# EAGLE design TRS breakout (EAGLE 9.2.0)
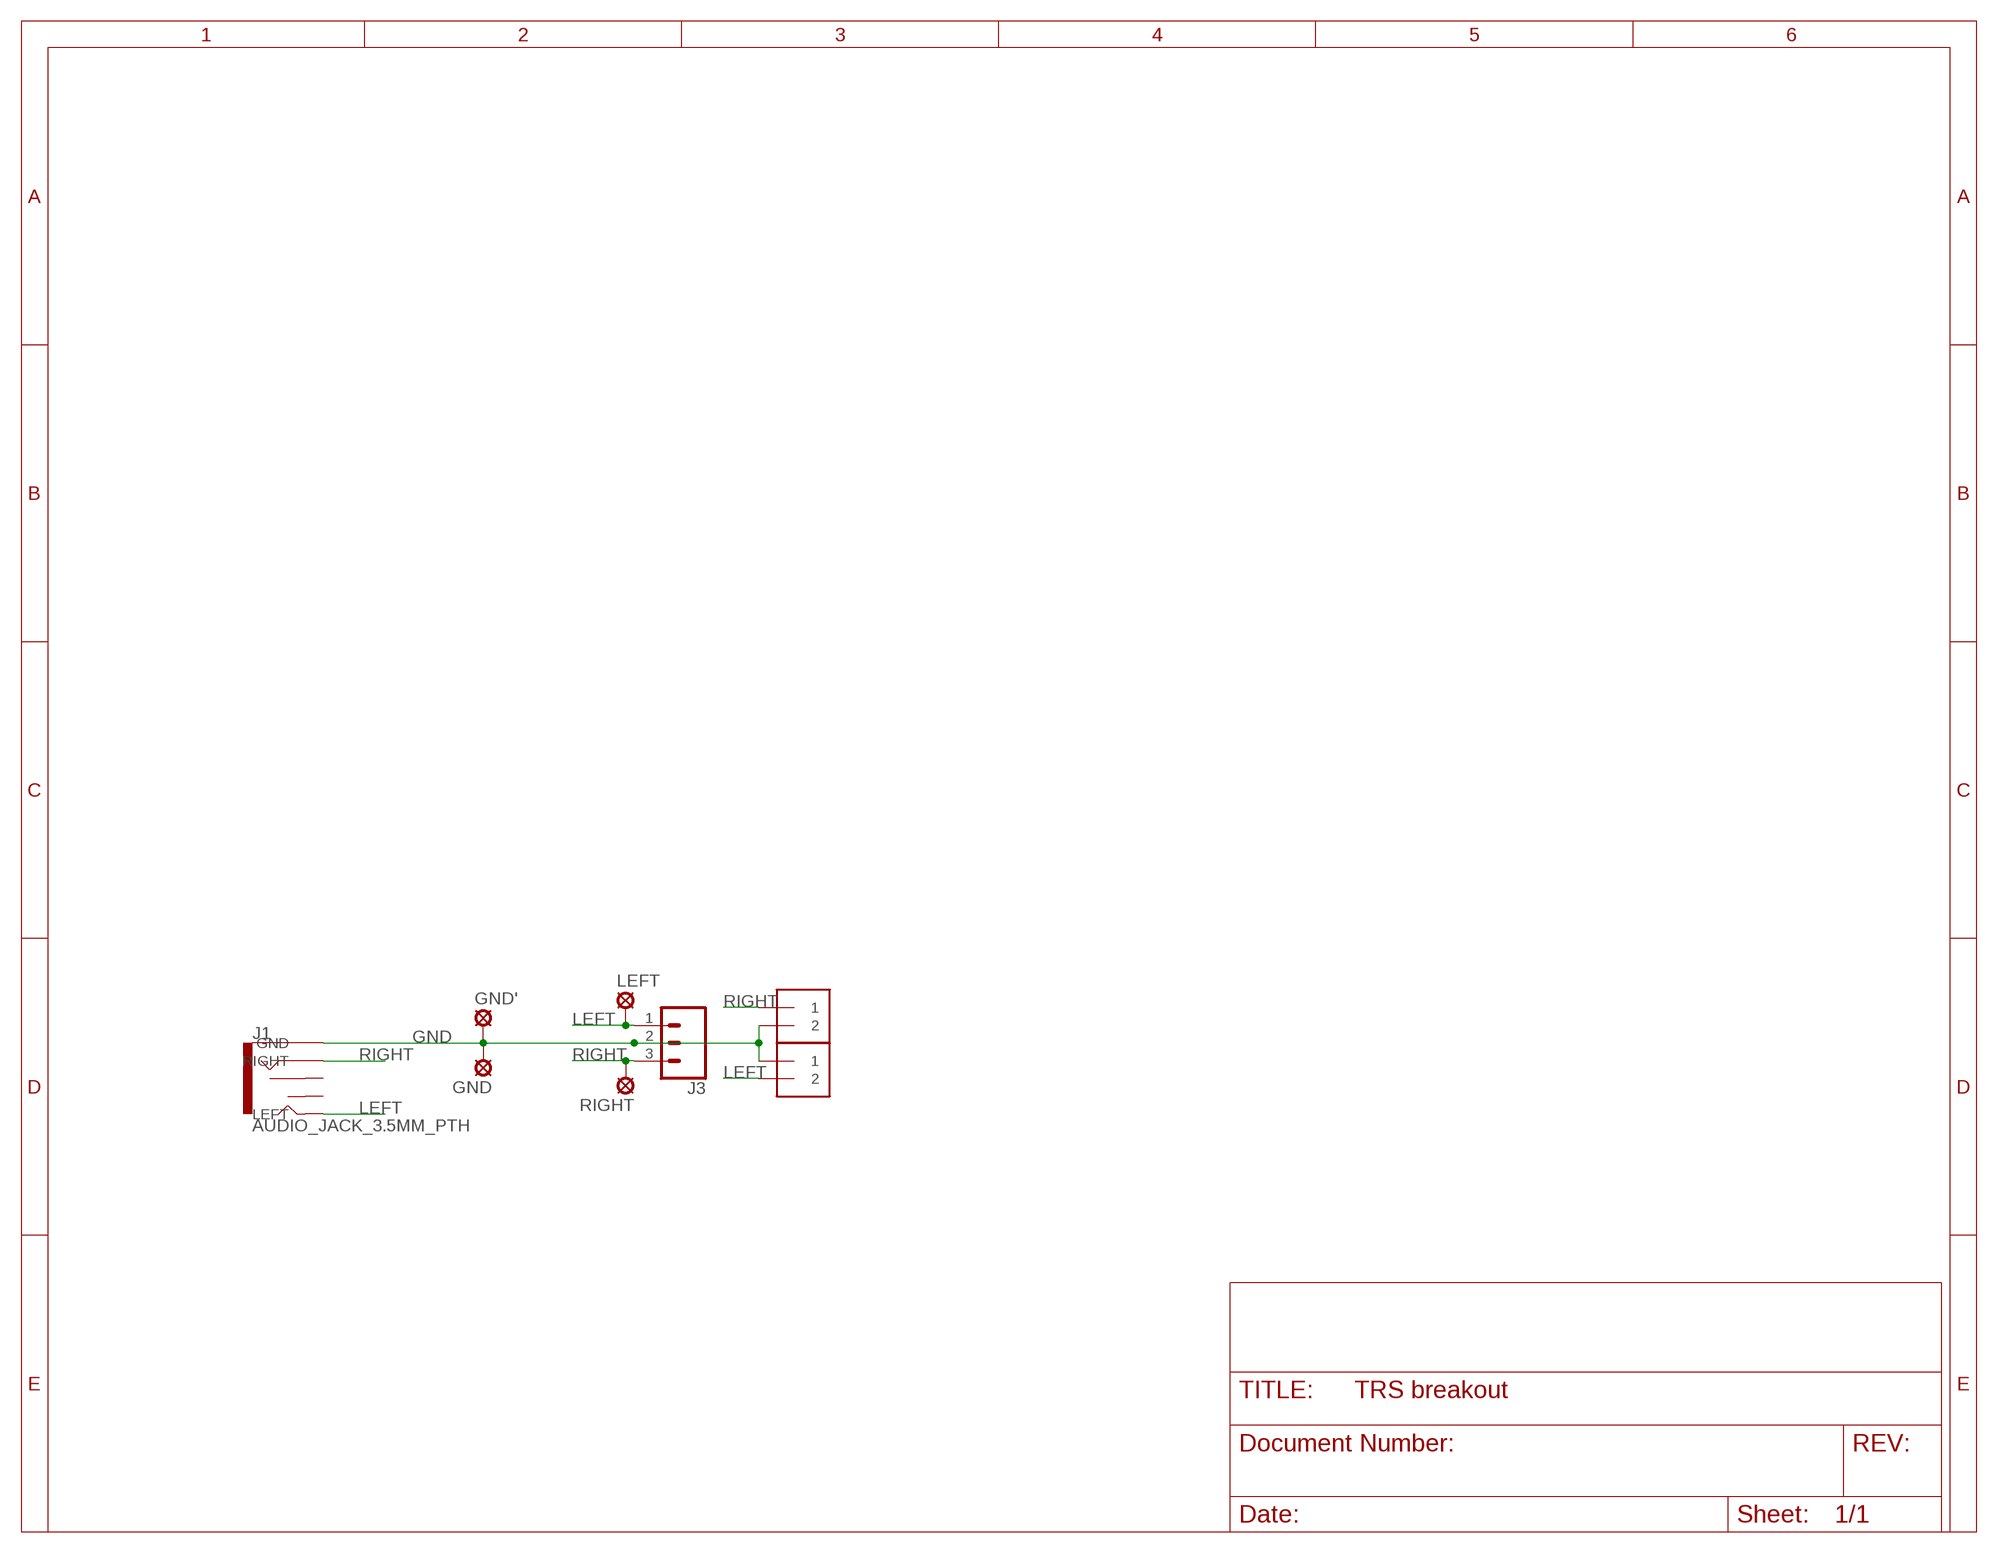
[diagram p0: schematic, sheet 1]

## Parts
GND  SE14  [SE14]
GND'  SE14  [SE14]
J1  AUDIO_JACK_3.5MM_PTH  [AUDIO-JACK]
J3  CONN_03LOCK_LONGPADS  [1X03_LOCK_LONGPADS]
J4  1X2-3.5MM  [1X2-3.5MM]
J5  1X2-3.5MM  [1X2-3.5MM]
LEFT  SE14  [SE14]
RIGHT  SE14  [SE14]

## Nets
GND: GND'.MP GND.MP J1.GND J3.2 J4.1 J5.2
LEFT: J1.LEFT J3.1 J4.2 LEFT.MP
RIGHT: J1.RIGHT J3.3 J5.1 RIGHT.MP
Unconnected: J1.RSH J1.TSH

## Library data of the parts
GND GND' LEFT RIGHT = solpad:SE14: SOLDER PAD E1553, drill 1,4mm, distributor Buerklin, 07F820
J1 = SparkFun-Connectors:AUDIO_JACK_3.5MM: Audio Jack 3.5mm variants of PTH and SMT stereo audio jack with bypass switches. SparkFun Products: SparkFun SparkPunk Sound Kit <[https://www.sparkfun.com/products/11177]> - PTH MP3 Trigger <https://www.sparkfun.com/products/13720> -3.5mm SMD SparkFun PicoBoard <https://www.sparkfun.com/products/11888>- 2.5mm SMD; PROD_ID: CONN-08774; SF_ID: PRT-08032
J3 = SparkFun-Connectors:CONN_03: Multi connection point. Often used as Generic Header-pin footprint for 0.1 inch spaced/style header connections On any of the 0.1 inch spaced packages, you can populate with these: Break Away Headers - Straight <https://www.sparkfun.com/products/116> (PRT-00116) Break Away Male Headers - Right Angle <https://www.sparkfun.com/products/553> (PRT-00553) Female Headers <https://www.sparkfun.com/products/115> (PRT-00115) Break Away Headers - Machine Pin <https://www.sparkfun.com/products/117> (PRT-00117) Break Away Female Headers - Swiss Machine Pin <https://www.sparkfun.com/products/743> (PRT-00743) Stackable Header - 3 Pin (Female, 0.1") <https://www.sparkfun.com/products/13875> (PRT-13875) For SCREWTERMINALS and SPRING TERMINALS visit here: Screw Terimnals on SparkFun.com <https://www.sparkfun.com/search/results?term=Screw+Terminals> (5mm/3.5mm/2.54mm spacing) This device is also useful as a general connection point to wire up your design to another part of your project. Our various solder wires solder well into these plated through hole pads. Hook-Up Wire - Assortment (Stranded, 22 AWG) <https://www.sparkfun.com/products/11375> (PRT-11375) Hook-Up Wire - Assortment (Solid Core, 22 AWG) <https://www.sparkfun.com/products/11367> (PRT-11367) View the entire wire category on our website here <https://www.sparkfun.com/categories/141> Special notes: Molex polarized connector foot print use with SKU : PRT-08232 with associated crimp pins and housings.
J4 J5 = adafruit:1X2: 3.5mm Terminal block http://www.ladyada.net/library/pcb/eaglelibrary.html

## Board
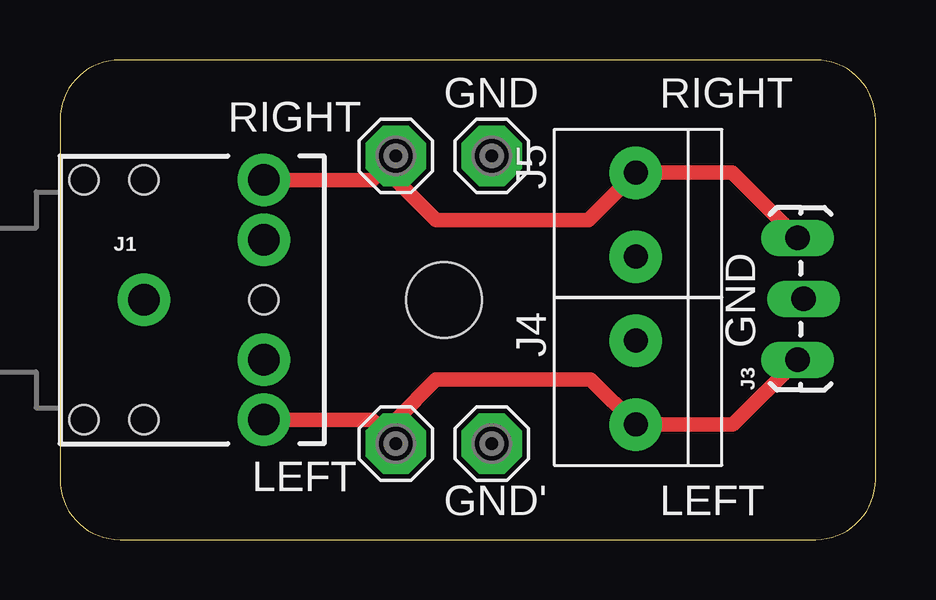
[diagram p1: board, top side]
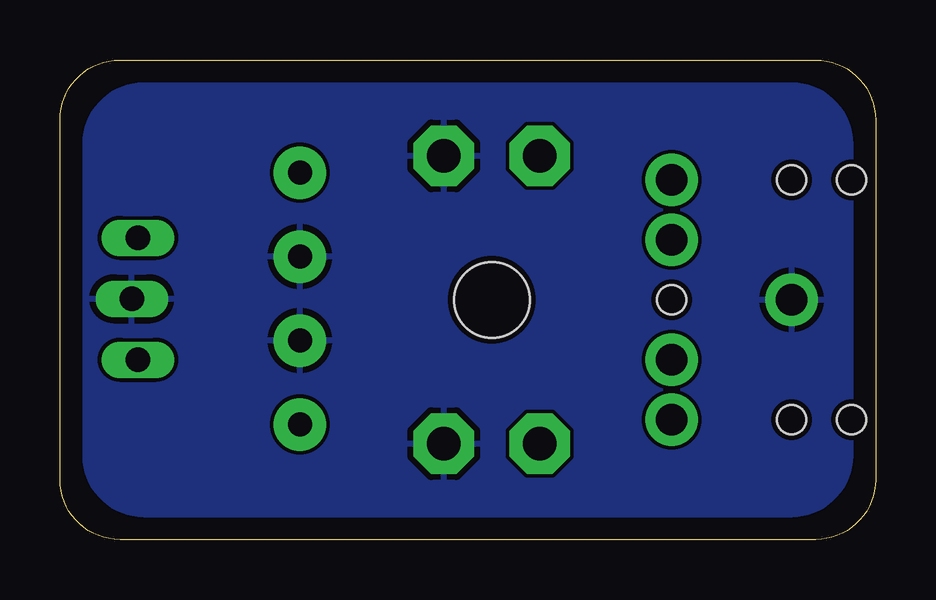
[diagram p2: board, bottom side, seen from below]

Size 34 x 20 mm. Coordinates in mm from the lower left corner, seen from the top.
Outline: 31.5,20 2.5,20 arc90 0,17.5 0,2.5 arc90 2.5,0 31.5,0 arc90 34,2.5 34,17.5 arc90 31.5,20
Copper layers (1*16): Top 0.035mm / dielectric 1.5mm / Bottom 0.035mm
Design rules "SeeedStudio_2layer_DRU_no_angle_20140221": minimum track width 6mil, minimum drill 12mil, track to track 6mil, track to pad 6mil, pad to pad 6mil, via to via 6mil, smd to smd 0mil, copper to edge 10mil, drill to drill 10mil, minimum pad ring 10mil, minimum via ring 6mil, stop-mask expansion 2mil, vias tented up to drill 100mil, thermal gap 10mil
Holes 3.15 mm at 16,10

### Footprints (pad centres in the part's own frame; a part is rotated, then mirrored left to right if it is on the bottom)
SE14 = drill 1.397 pad 2.54 octagon: MP 0,0
AUDIO-JACK = drill 1.3 pad 2.184: GND 0,0; LEFT 5,-5; RIGHT 5,5; RSH 5,2.5; TSH 5,-2.5 | hole 1.2: 0,5; -2.5,5; -2.5,-5; 0,-5; 5,0
1X03_LOCK_LONGPADS = drill 1.016 long: 1 0,0; 2 2.54,-0.254; 3 5.08,0
1X2-3.5MM = drill 1 pad 2.184: 1 1.8,0; 2 -1.7,0

### Placement (x,y rotation side)
GND  18,16 0 top
GND'  18,4 0 top
J1  3.5,10 0 top
J3  30.75,7.5 90 top
J4  24,6.5 90 top
J5  24,13.5 90 top
LEFT  14,4 0 top
RIGHT  14,16 0 top

### Tracks (layer width: path | path; a pad name or v marks a point on that pad's centre or on a via)
GND
  pour Bottom: 30.5,1 3.5,1 arc-90 1,3.5 1,16.5 arc-90 3.5,19 30.5,19 arc-90 33,16.5 33,3.5 arc-90
LEFT
  Top 0.61: J3.1 28.05,4.8 J4.2 22.12,6.68 15.68,6.68 14,5 LEFT.MP 13,5 J1.LEFT
RIGHT
  Top 0.61: J3.3 28.03,15.3 J5.1 22.02,13.32 15.68,13.32 14,15 RIGHT.MP 13,15 J1.RIGHT

### Text on the board
tPlace: RIGHT | GND | LEFT